# Altium schematic sheet Out_Inputs.SchDoc
size A4; SheetNumber: 4; SheetTotal: 4
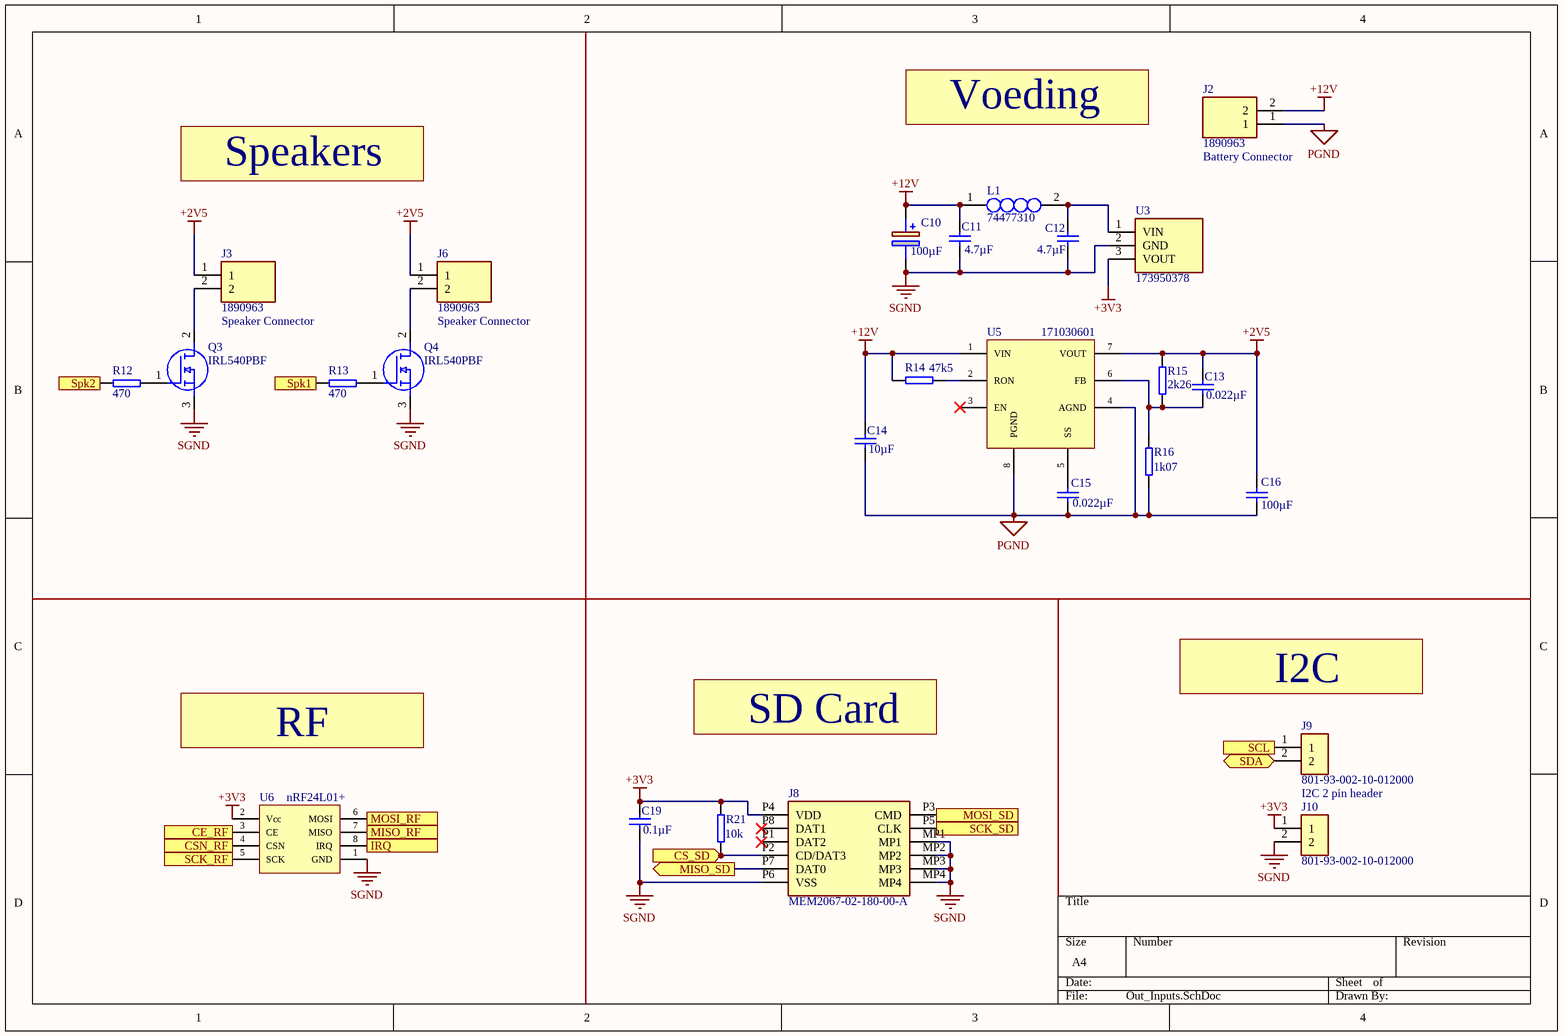
[diagram p0: Out_Inputs.SchDoc]

## Parts
C10  100µF  [CAPPRD350W52D800H1300]
C11  4.7µF  [Capacitor 1206]
C12  4.7µF  [Capacitor 1206]
C13  0.022µF  [Capacitor 0603]
C14  10µF  [Capacitor 0603]
C15  0.022µF  [Capacitor 0603]
C16  100µF  [Cap_1210]
C19  0.1µF  [Capacitor 0603]
J2  1890963  [1890963]
J3  1890963  [1890963]
J6  1890963  [1890963]
J8  MEM2067-02-180-00-A  [MEM20670218000A]
J9  801-93-002-10-012000  [801-93-002-10-012000]
J10  801-93-002-10-012000  [801-93-002-10-012000]
L1  74477310  [WE-PD2_453255]
Q3  IRL540PBF  [TO-220-3]
Q4  IRL540PBF  [TO-220-3]
R12  470  [Resistor 0603]
R13  470  [Resistor 0603]
R14  47k5  [Resistor 0603]
R15  2k26  [Resistor 0603]
R16  1k07  [Resistor 0603]
R21  10k  [Resistor 0603]
U3  173950378  [173950378]
U5  171030601  [TO263-7EP]
U6  nRF24L01+  [nRF24L01+]

## Ports
CE_RF (in, see Main_Board_Tank[3A]), CS_SD (in, see Main_Board_Tank[3B]), CSN_RF (in, see Main_Board_Tank[3A]), IRQ (out, see Main_Board_Tank[3A]), MISO_RF (out, see Main_Board_Tank[3A]), MISO_SD (out, see Main_Board_Tank[3A]), MOSI_RF (in, see Main_Board_Tank[3A]), MOSI_SD (in, see Main_Board_Tank[3B]), SCK_RF (in, see Main_Board_Tank[3A]), SCK_SD (in, see Main_Board_Tank[3B]), SCL (in, see Main_Board_Tank[3B]), SDA (bidir, see Main_Board_Tank[3B]), Spk1 (in, see Main_Board_Tank[3A]), Spk2 (in, see Main_Board_Tank[3A])

## Nets
+2V5: C13.1 C16.2 J3.1 J6.1 R15.1 U5.7(VOUT)
+3V3: C19.1 J8.P4(VDD) J10.1 R21.1 U3.3(VOUT) U6.2(Vcc)
+12V: C10.1(+) C11.1 C14.1 J2.2 L1.1 R14.1 U5.1(VIN)
PGND: C14.2 C15.1 C16.1 J2.1 R16.2 U5.4(AGND) U5.8(PGND)
SGND: C10.2(-) C11.2 C12.2 C19.2 J8.MP1 J8.MP2 J8.MP3 J8.MP4 J8.P6(VSS) J10.2 Q3.3(S) Q4.3(S) U3.2(GND) U6.1(GND)
CE_RF: U6.3(CE) ; port CE_RF
CS_SD: J8.P2(CD/DAT3) R21.2 ; port CS_SD
CSN_RF: U6.4(CSN) ; port CSN_RF
IRQ: U6.8(IRQ) ; port IRQ
MISO_RF: U6.7(MISO) ; port MISO_RF
MISO_SD: J8.P7(DAT0) ; port MISO_SD
MOSI_RF: U6.6(MOSI) ; port MOSI_RF
MOSI_SD: J8.P3(CMD) ; port MOSI_SD
SCK_RF: U6.5(SCK) ; port SCK_RF
SCK_SD: J8.P5(CLK) ; port SCK_SD
SCL: J9.1 ; port SCL
SDA: J9.2 ; port SDA
Spk1: R13.1 ; port Spk1
Spk2: R12.1 ; port Spk2
NetC12_1: C12.1 L1.2 U3.1(VIN)
NetC13_2: C13.2 R15.2 R16.1 U5.6(FB)
NetC15_2: C15.2 U5.5(SS)
NetJ3_2: J3.2 Q3.2(D)
NetJ6_2: J6.2 Q4.2(D)
NetQ3_1: Q3.1(G) R12.2
NetQ4_1: Q4.1(G) R13.2
NetR14_2: R14.2 U5.2(RON)

Not connected (* = marked no-connect by the designer): J8 P1(DAT2)* P8(DAT1)*; U5 3(EN)*

## Notes on the sheet
- Voeding
- Speakers
- (near J2) Battery Connector
- Speaker Connector
- I2C
- RF
- SD Card
- I2C 2 pin header

## Library data of the parts
C10 = 860010674014: Wurth Elektronik 100uF 50 V dc Aluminium Electrolytic Capacitor; Manufacturer_Part_Number: 865080543009; Geometry.Height: 5.5mm; Mouser Part Number: 710-865080543009; Mouser Price/Stock: https://www.mouser.co.uk/ProductDetail/Wurth-Elektronik/865080543009?qs=0KOYDY2FL2%2F%252BYmhMLtEhDQ%3D%3D; Manufacturer_Name: Wurth Elektronik; Datasheet Link: https://katalog.we-online.de/pbs/datasheet/865080543009.pdf; Mouser: 710-860010674014
C11 C12 = Capacitor 1206: Capacitor; Mouser: 710-885012208094
C13-C15 C19 = Capacitor 0603: Capacitor
C16 = Capacitor 1210: Capacitor
J2 J3 J6 = 1890963: Connector: 2pin screw terminal; Manufacturer_Name: Phoenix Contact; Datasheet Link: http://www.phoenixcontact.com/de/produkte/1890963/pdf; Height: 15.15mm; Manufacturer_Part_Number: 1890963; Mouser Part Number: 651-1890963; Mouser Price/Stock: https://www.mouser.co.uk/ProductDetail/Phoenix-Contact/1890963?qs=5W%252BNKB25SvKX6KIA0xFJOA%3D%3D; Arrow Part Number: 1890963; Arrow Price/Stock: https://www.arrow.com/en/products/1890963/phoenix-contact?region=nac
J8 = MEM2067-02-180-00-A: GCT (GLOBAL CONNECTOR TECHNOLOGY) - MEM2067-02-180-00-A - Memory Socket, MEM2067 Series, Memory Card, 8 Contacts, Copper Alloy, Gold Plated Contacts; Geometry.Height: 1.95mm; Mouser Part Number: 640-MEM20670218000A; Mouser Price/Stock: https://www.mouser.co.uk/ProductDetail/GCT/MEM2067-02-180-00-A?qs=KUoIvG%2F9IlYTw%2Fcc1GlNJA%3D%3D; Manufacturer_Name: GCT (GLOBAL CONNECTOR TECHNOLOGY); Manufacturer_Part_Number: MEM2067-02-180-00-A; Datasheet Link: https://gct.co/files/drawings/mem2067.pdf
J9 J10 = 801-93-002-10-012000: 2 pin header 2.54mm pitch; Mouser: 575-8019300210012000
L1 = 7447730: Inductor; Manufacturer_Name: Wurth Elektronik; Manufacturer_Part_Number: 7447730; Mouser Part Number: 710-7447730; Mouser Price/Stock: https://www.mouser.co.uk/ProductDetail/Wurth-Elektronik/7447730?qs=rS3zZhy2AQMpnsrOMerOTw%3D%3D; Mouser: 710-74477310
Q3 Q4 = IRL540PBF: MOSFET N-CH  100V HEXFET MOSFET; Manufacturer_Name: Vishay; Geometry.Height: 4.65mm; Mouser Part Number: 844-IRL540PBF; Mouser Price/Stock: https://www.mouser.co.uk/ProductDetail/Vishay-Semiconductors/IRL540PBF?qs=cvaI6ThkwxvX4jX2UNqT3g%3D%3D; Manufacturer_Part_Number: IRL540PBF; Datasheet Link: https://componentsearchengine.com/Datasheets/1/IRL540PBF.pdf
R12-R16 R21 = Resistor 0603: Resistor
U3 = 173950378: MagI3C Power Module 0.5A 3.3V 6-28V SIP3; Manufacturer_Name: Wurth Elektronik; Geometry.Height: 11mm; Mouser Part Number: 710-173950378; Mouser Price/Stock: https://www.mouser.co.uk/ProductDetail/Wurth-Elektronik/173950378?qs=SElPoaY2y5Iv2HEnICmd%252BA%3D%3D; Manufacturer_Part_Number: 173950378; Datasheet Link: http://katalog.we-online.de/pm/datasheet/173950378.pdf
U5 = CMP-533-000007-A.2: MagI3C-VDRM Variable Step Down Regulator Module, TO263-7EP, 6-42Vin, 3Aout; Manufacturer: Wurth Electronics; Input Voltage: 6-42V; Output Current: 3A; Output Voltage: 0.8-6V; ComponentLink1Description: Manufacturer; ComponentLink1URL: http://www.we-online.de; ComponentLink2Description: Datasheet; ComponentLink2URL: https://katalog.we-online.de/pm/datasheet/171030601.pdf; Mounting Technology: SMT; Operating Temperature: -40 to +125degC; Manufacturer Part Number: 171030601; Packaging: Tape and Reel; Published Date: April 2020; Size: TO263-7EP; Pin Count: 8; Source: MagI3C-VDRM_TO263-7EP.SchLib; Design Item ID: 171030601; Component Type: MagI3C VDRM